# EAGLE schematic seamonster_buffered3 (EAGLE 9.0.1)

## Sheet 1 of 5: Power Filtering & Bypass
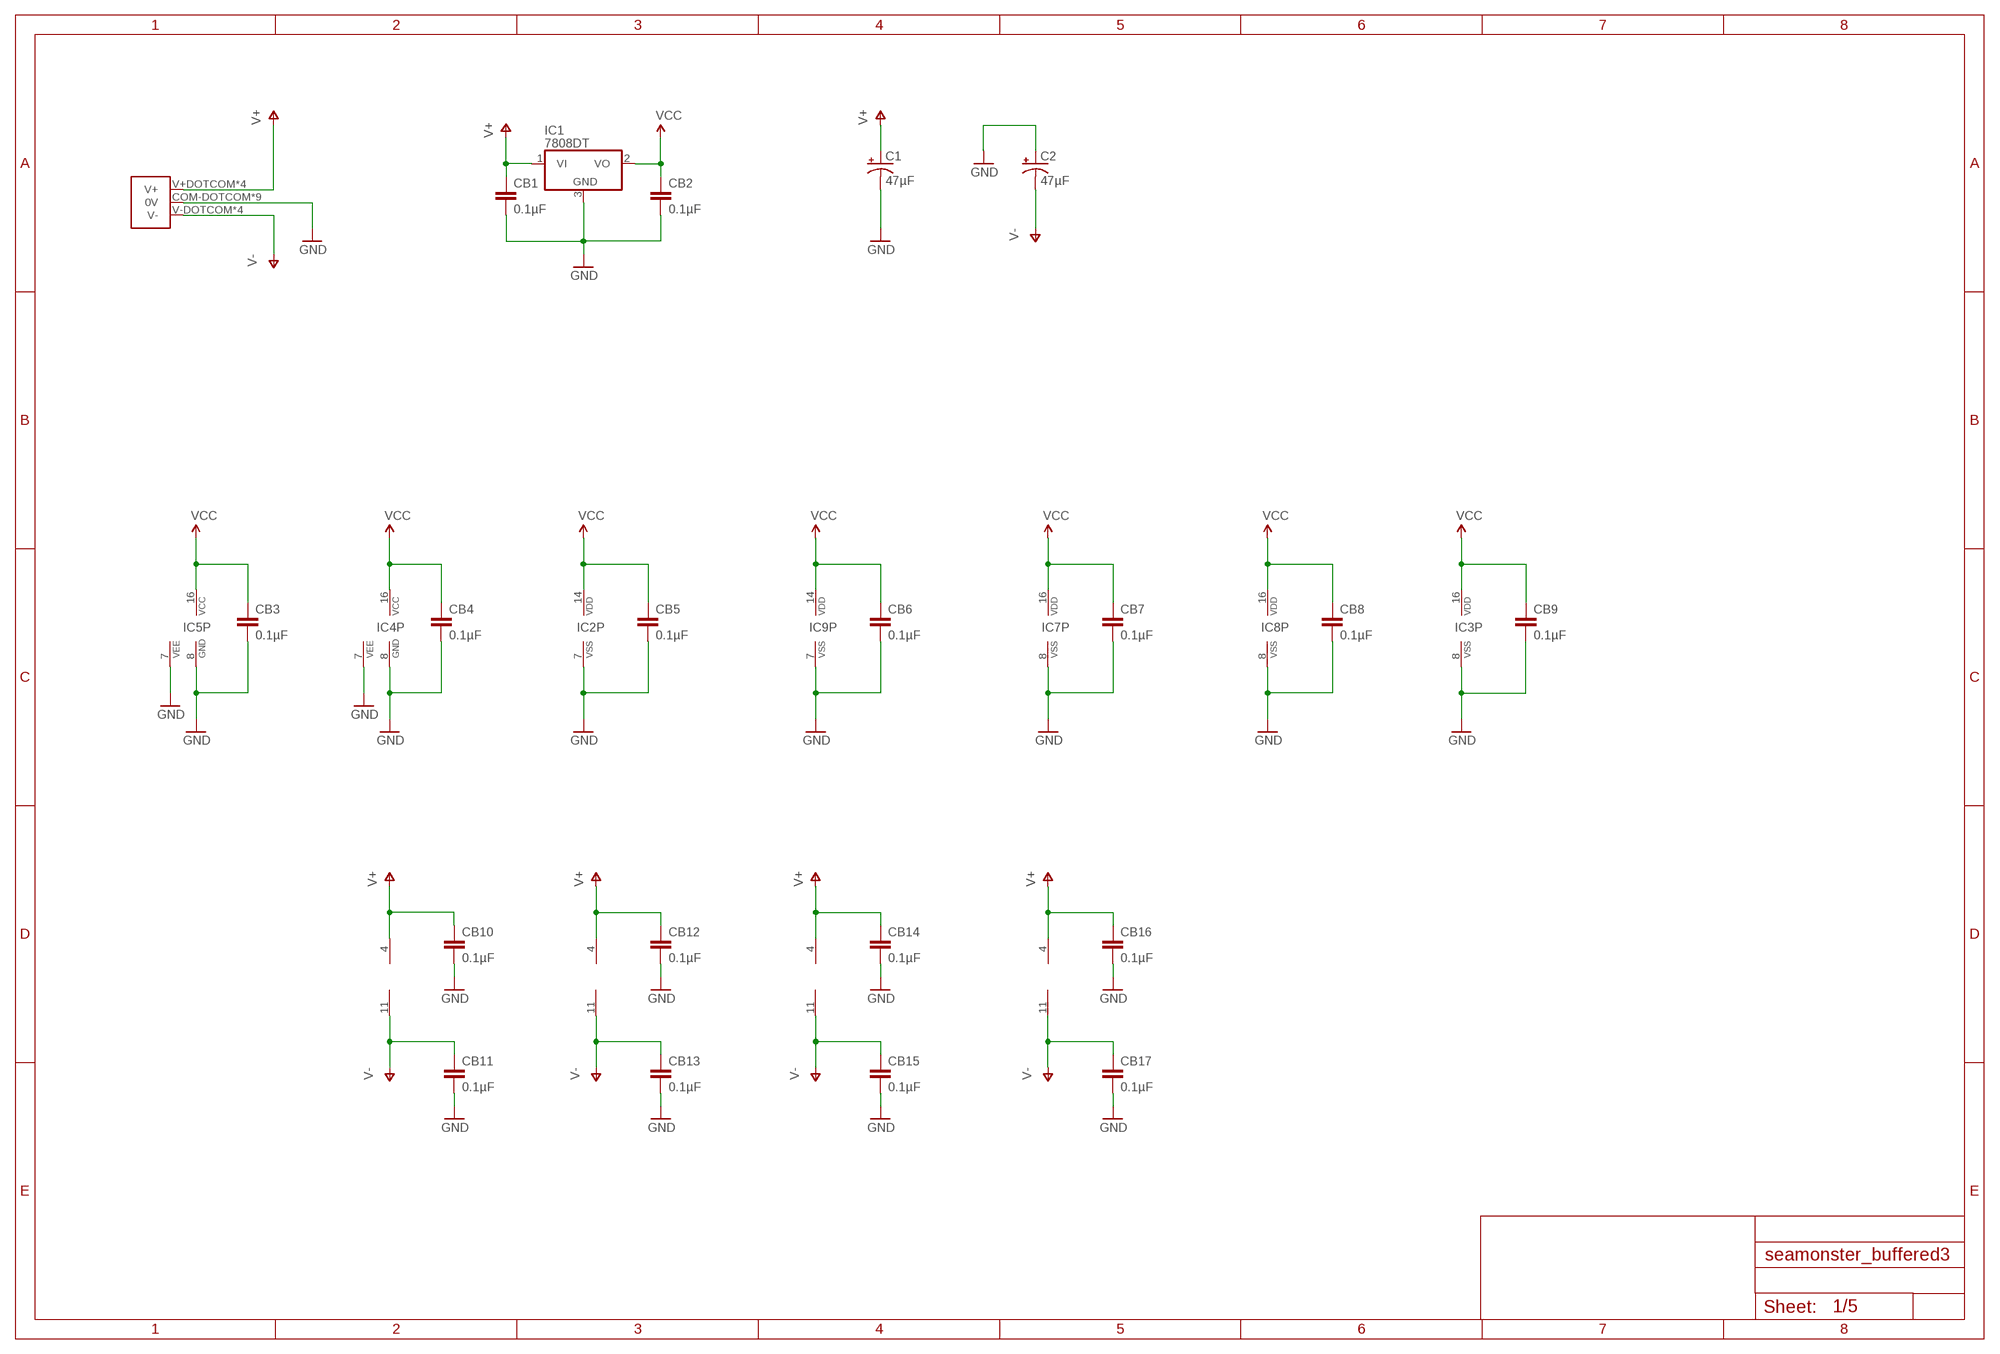
[diagram p0: schematic, sheet 1]

### Parts
C1  47µF  CAP_POLPTH2  [CPOL-RADIAL-10UF-25V]
C2  47µF  CAP_POLPTH2  [CPOL-RADIAL-10UF-25V]
CB1  0.1µF  CAP0805  [0805]
CB2  0.1µF  CAP0805  [0805]
CB3  0.1µF  CAP0805  [0805]
CB4  0.1µF  CAP0805  [0805]
CB5  0.1µF  CAP0805  [0805]
CB6  0.1µF  CAP0805  [0805]
CB7  0.1µF  CAP0805  [0805]
CB8  0.1µF  CAP0805  [0805]
CB9  0.1µF  CAP0805  [0805]
CB10  0.1µF  CAP0805  [0805]
CB11  0.1µF  CAP0805  [0805]
CB12  0.1µF  CAP0805  [0805]
CB13  0.1µF  CAP0805  [0805]
CB14  0.1µF  CAP0805  [0805]
CB15  0.1µF  CAP0805  [0805]
CB16  0.1µF  CAP0805  [0805]
CB17  0.1µF  CAP0805  [0805]
IC1  7808DT  [TO252]
IC2  40106D  [SO14]
IC3  4040D  [SO16]
IC4  4051D  [SO16]
IC5  4051D  [SO16]
IC7  4046D  [SO16]
IC8  4046D  [SO16]
IC9  4070D  [SO14]
U1  TL084  TL074_SMD  [SO14]
U2  TL084  TL074_SMD  [SO14]
U3  TL084  TL074_SMD  [SO14]
U4  TL084D  [SO14]
U$1  COMBO_POWER  [COMBO_POWER]

### Nets
GND: C1.2(-) C2.1(+) CB1.2 CB2.2 CB3.2 CB4.2 CB5.2 CB6.2 CB7.2 CB8.2 CB9.2 CB10.2 CB11.2 CB12.2 CB13.2 CB14.2 CB15.2 CB16.2 CB17.2 IC1.3(GND) IC2.7(P:VSS) IC3.8(VSS) IC4.7(VEE) IC4.8(GND) IC5.7(VEE) IC5.8(GND) IC7.8(VSS) IC8.8(VSS) IC9.7(P:VSS) U$1.COM-DOTCOM(0V) U$1.COM-EURO1(0V) U$1.COM-EURO2(0V) U$1.COM-EURO3(0V) U$1.COM-EURO4(0V) U$1.COM-EURO5(0V) U$1.COM-EURO6(0V) U$1.COM-MOTM1(0V) U$1.COM_MOTM2(0V) ; also sheet 2,3,4,5
V+: C1.1(+) CB1.1 CB10.1 CB12.1 CB14.1 CB16.1 IC1.1(VI) U1.4(P:V+) U2.4(P:V+) U3.4(P:V+) U4.4(P:V+) U$1.V+DOTCOM(V+) U$1.V+EURO1(V+) U$1.V+EURO2(V+) U$1.V+MOTM(V+) ; also sheet 3
V-: C2.2(-) CB11.1 CB13.1 CB15.1 CB17.1 U1.11(P:V-) U2.11(P:V-) U3.11(P:V-) U4.11(P:V-) U$1.V-DOTCOM(V-) U$1.V-EURO1(V-) U$1.V-EURO2(V-) U$1.V-MOTM(V-) ; also sheet 3
VCC: CB2.1 CB3.1 CB4.1 CB5.1 CB6.1 CB7.1 CB8.1 CB9.1 IC1.2(VO) IC2.14(P:VDD) IC3.16(VDD) IC4.16(VCC) IC5.16(VCC) IC7.16(VDD) IC8.16(VDD) IC9.14(P:VDD) ; also sheet 3
Unconnected: IC2.12(F:O) IC2.13(F:I)

## Sheet 2 of 5: Clock Oscillator & Divider
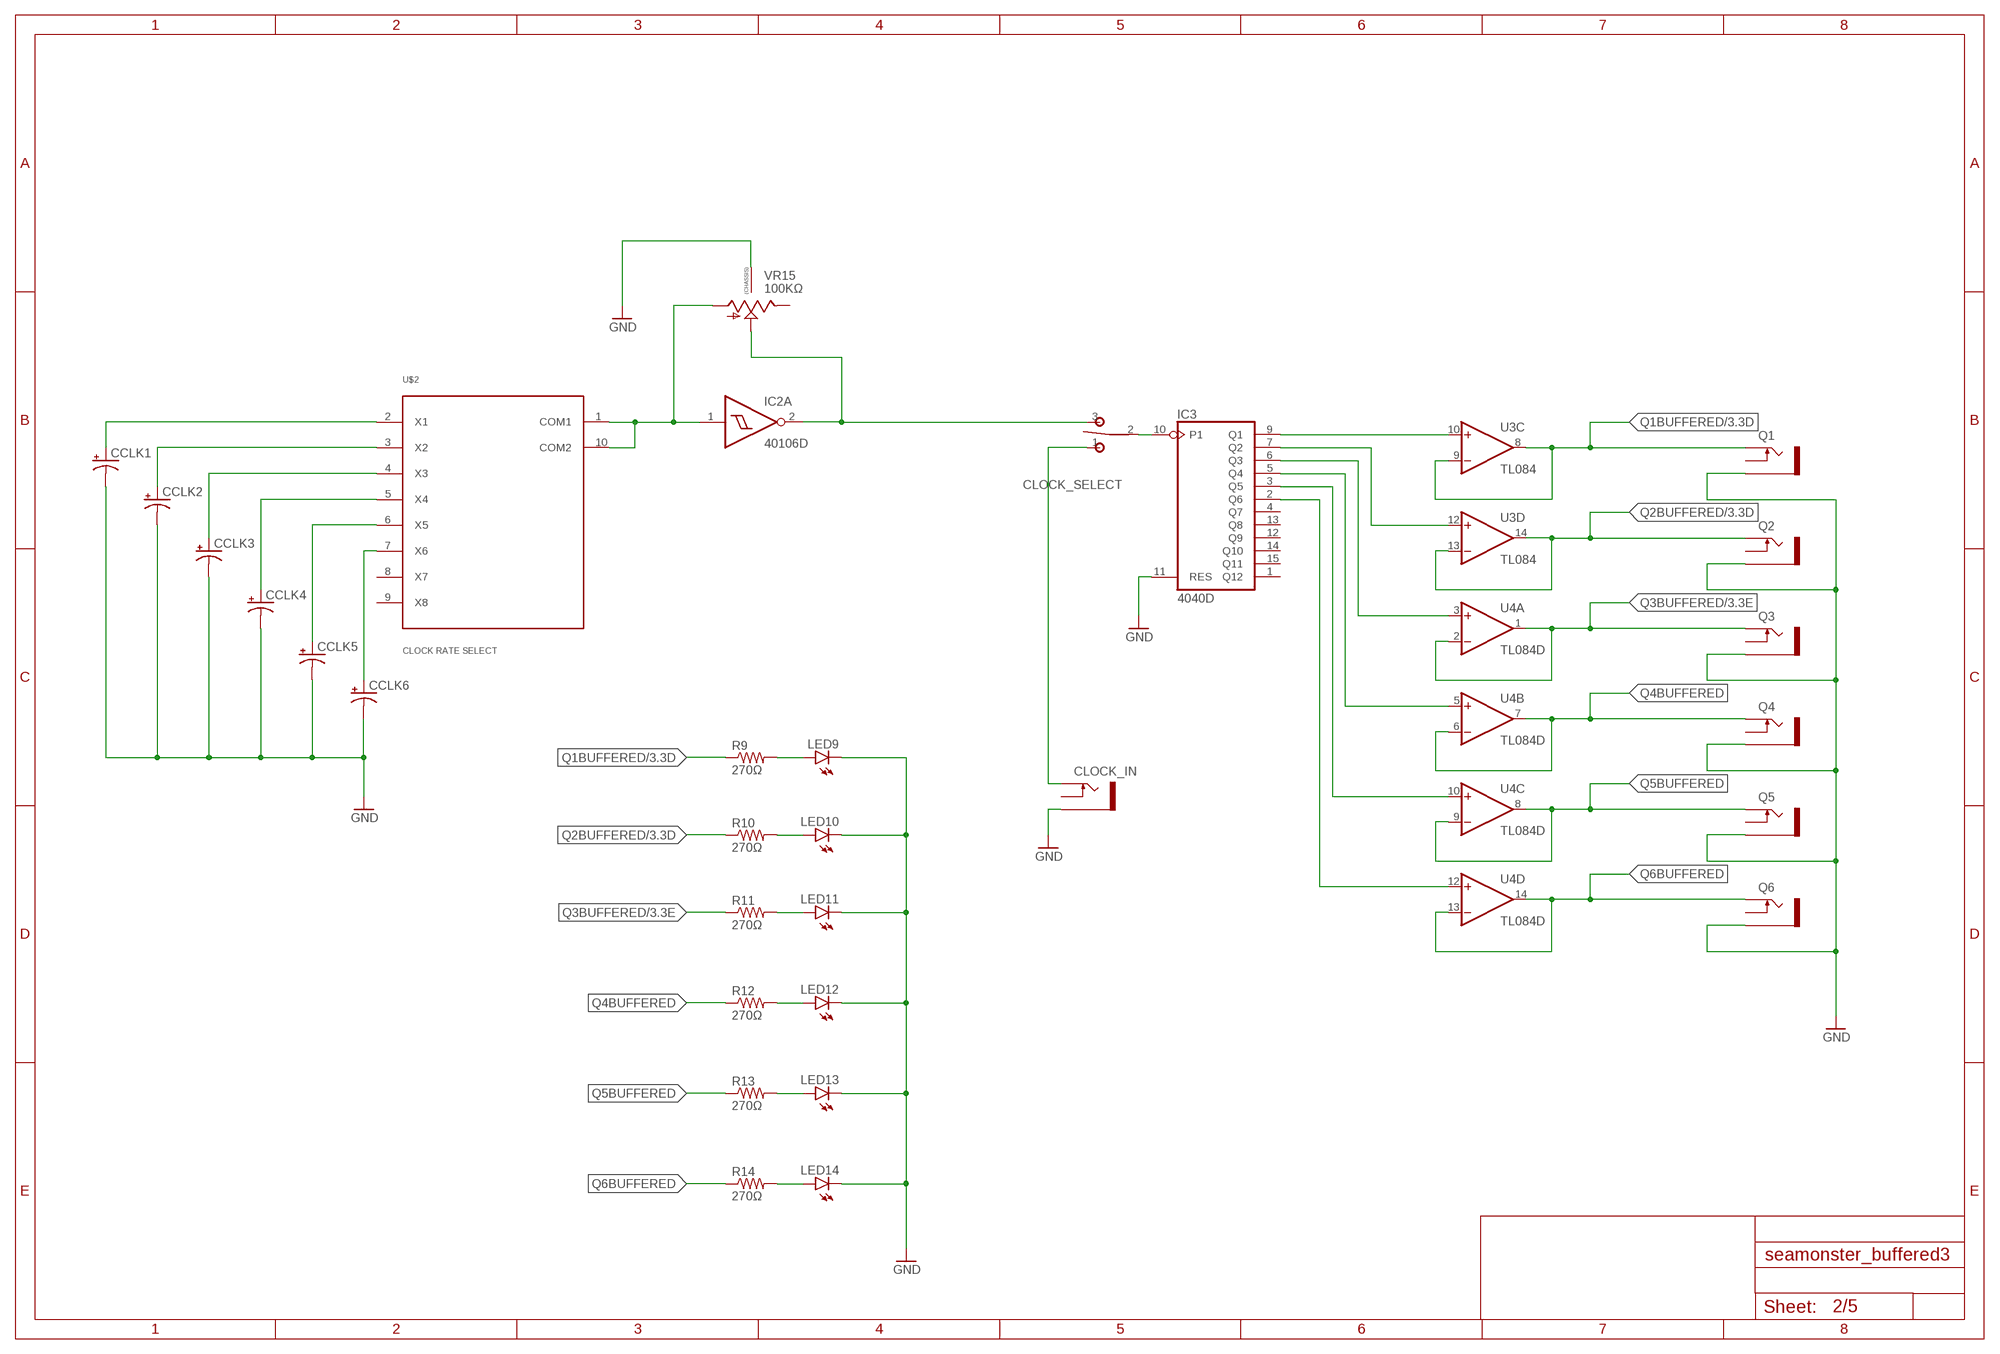
[diagram p1: schematic, sheet 2]

### Parts
CCLK1  10UF-25V-20%(PTH)  [CPOL-RADIAL-10UF-25V]
CCLK2  10UF-25V-20%(PTH)  [CPOL-RADIAL-10UF-25V]
CCLK3  10UF-25V-20%(PTH)  [CPOL-RADIAL-10UF-25V]
CCLK4  10UF-25V-20%(PTH)  [CPOL-RADIAL-10UF-25V]
CCLK5  10UF-25V-20%(PTH)  [CPOL-RADIAL-10UF-25V]
CCLK6  10UF-25V-20%(PTH)  [CPOL-RADIAL-10UF-25V]
CLOCK_IN  THONKICONNNEW  [WQP-PJ301M-12_JACK]
CLOCK_SELECT  SPDT ON-ON  T-80-T-SPDT-ON-OFF-ON  [M9040P]
LED9  LED3MM  [LED3MM]
LED10  LED3MM  [LED3MM]
LED11  LED3MM  [LED3MM]
LED12  LED3MM  [LED3MM]
LED13  LED3MM  [LED3MM]
LED14  LED3MM  [LED3MM]
Q1  THONKICONNNEW  [WQP-PJ301M-12_JACK]
Q2  THONKICONNNEW  [WQP-PJ301M-12_JACK]
Q3  THONKICONNNEW  [WQP-PJ301M-12_JACK]
Q4  THONKICONNNEW  [WQP-PJ301M-12_JACK]
Q5  THONKICONNNEW  [WQP-PJ301M-12_JACK]
Q6  THONKICONNNEW  [WQP-PJ301M-12_JACK]
R9  270Ω  RESISTOR0805-RES  [0805]
R10  270Ω  RESISTOR0805-RES  [0805]
R11  270Ω  RESISTOR0805-RES  [0805]
R12  270Ω  RESISTOR0805-RES  [0805]
R13  270Ω  RESISTOR0805-RES  [0805]
R14  270Ω  RESISTOR0805-RES  [0805]
U$2  CLOCK RATE SELECT  ALPHA_ROTARY_SWITCH  [ALPHA_SR1712F]
VR15  100KΩ  9MM_SNAP-IN_POT_CHASSIS  [9MM_SNAP-IN_POT]

### Nets
GND: CCLK1.2(-) CCLK2.2(-) CCLK3.2(-) CCLK4.2(-) CCLK5.2(-) CCLK6.2(-) CLOCK_IN.P$3_SLEEVE(SLEEVE) IC3.11(RES) LED9.K(C) LED10.K(C) LED11.K(C) LED12.K(C) LED13.K(C) LED14.K(C) Q1.P$3_SLEEVE(SLEEVE) Q2.P$3_SLEEVE(SLEEVE) Q3.P$3_SLEEVE(SLEEVE) Q4.P$3_SLEEVE(SLEEVE) Q5.P$3_SLEEVE(SLEEVE) Q6.P$3_SLEEVE(SLEEVE) VR15.CHASSIS2 ; also sheet 1,3,4,5
N$2: IC2.1(A:I) U$2.1(COM1) U$2.10(COM2) VR15.1(A)
N$3: CCLK1.1(+) U$2.2(X1)
N$4: CCLK2.1(+) U$2.3(X2)
N$5: CCLK3.1(+) U$2.4(X3)
N$6: CCLK4.1(+) U$2.5(X4)
N$7: CCLK5.1(+) U$2.6(X5)
N$8: CCLK6.1(+) U$2.7(X6)
N$43: CLOCK_SELECT.3(S) IC2.2(A:O) VR15.2(S)
N$50: CLOCK_SELECT.2(P) IC3.10(P1)
N$51: LED9.A R9.2
N$61: IC3.9(Q1) U3.10(C:+IN)
N$65: LED10.A R10.2
N$66: LED11.A R11.2
N$67: LED12.A R12.2
N$68: LED13.A R13.2
N$69: LED14.A R14.2
N$70: CLOCK_IN.P$1_TIP(TIP) CLOCK_SELECT.1(O)
Q1BUFFERED: Q1.P$1_TIP(TIP) R9.1 U3.8(C:OUT) U3.9(C:-IN) ; also sheet 3
Q2: IC3.7(Q2) U3.12(D:+IN)
Q2BUFFERED: Q2.P$1_TIP(TIP) R10.1 U3.13(D:-IN) U3.14(D:OUT) ; also sheet 3
Q3: IC3.6(Q3) U4.3(A:+IN)
Q3BUFFERED: Q3.P$1_TIP(TIP) R11.1 U4.1(A:OUT) U4.2(A:-IN) ; also sheet 3
Q4: IC3.5(Q4) U4.5(B:+IN)
Q4BUFFERED: Q4.P$1_TIP(TIP) R12.1 U4.6(B:-IN) U4.7(B:OUT)
Q5: IC3.3(Q5) U4.10(C:+IN)
Q5BUFFERED: Q5.P$1_TIP(TIP) R13.1 U4.8(C:OUT) U4.9(C:-IN)
Q6: IC3.2(Q6) U4.12(D:+IN)
Q6BUFFERED: Q6.P$1_TIP(TIP) R14.1 U4.13(D:-IN) U4.14(D:OUT)
Unconnected: CLOCK_IN.P$2_SWITCH(SWITCH) IC3.1(Q12) IC3.4(Q7) IC3.12(Q9) IC3.13(Q8) IC3.14(Q10) IC3.15(Q11) Q1.P$2_SWITCH(SWITCH) Q2.P$2_SWITCH(SWITCH) Q3.P$2_SWITCH(SWITCH) Q4.P$2_SWITCH(SWITCH) Q5.P$2_SWITCH(SWITCH) Q6.P$2_SWITCH(SWITCH) U$2.8(X7) U$2.9(X8) VR15.3(E)

## Sheet 3 of 5: Multiplexing
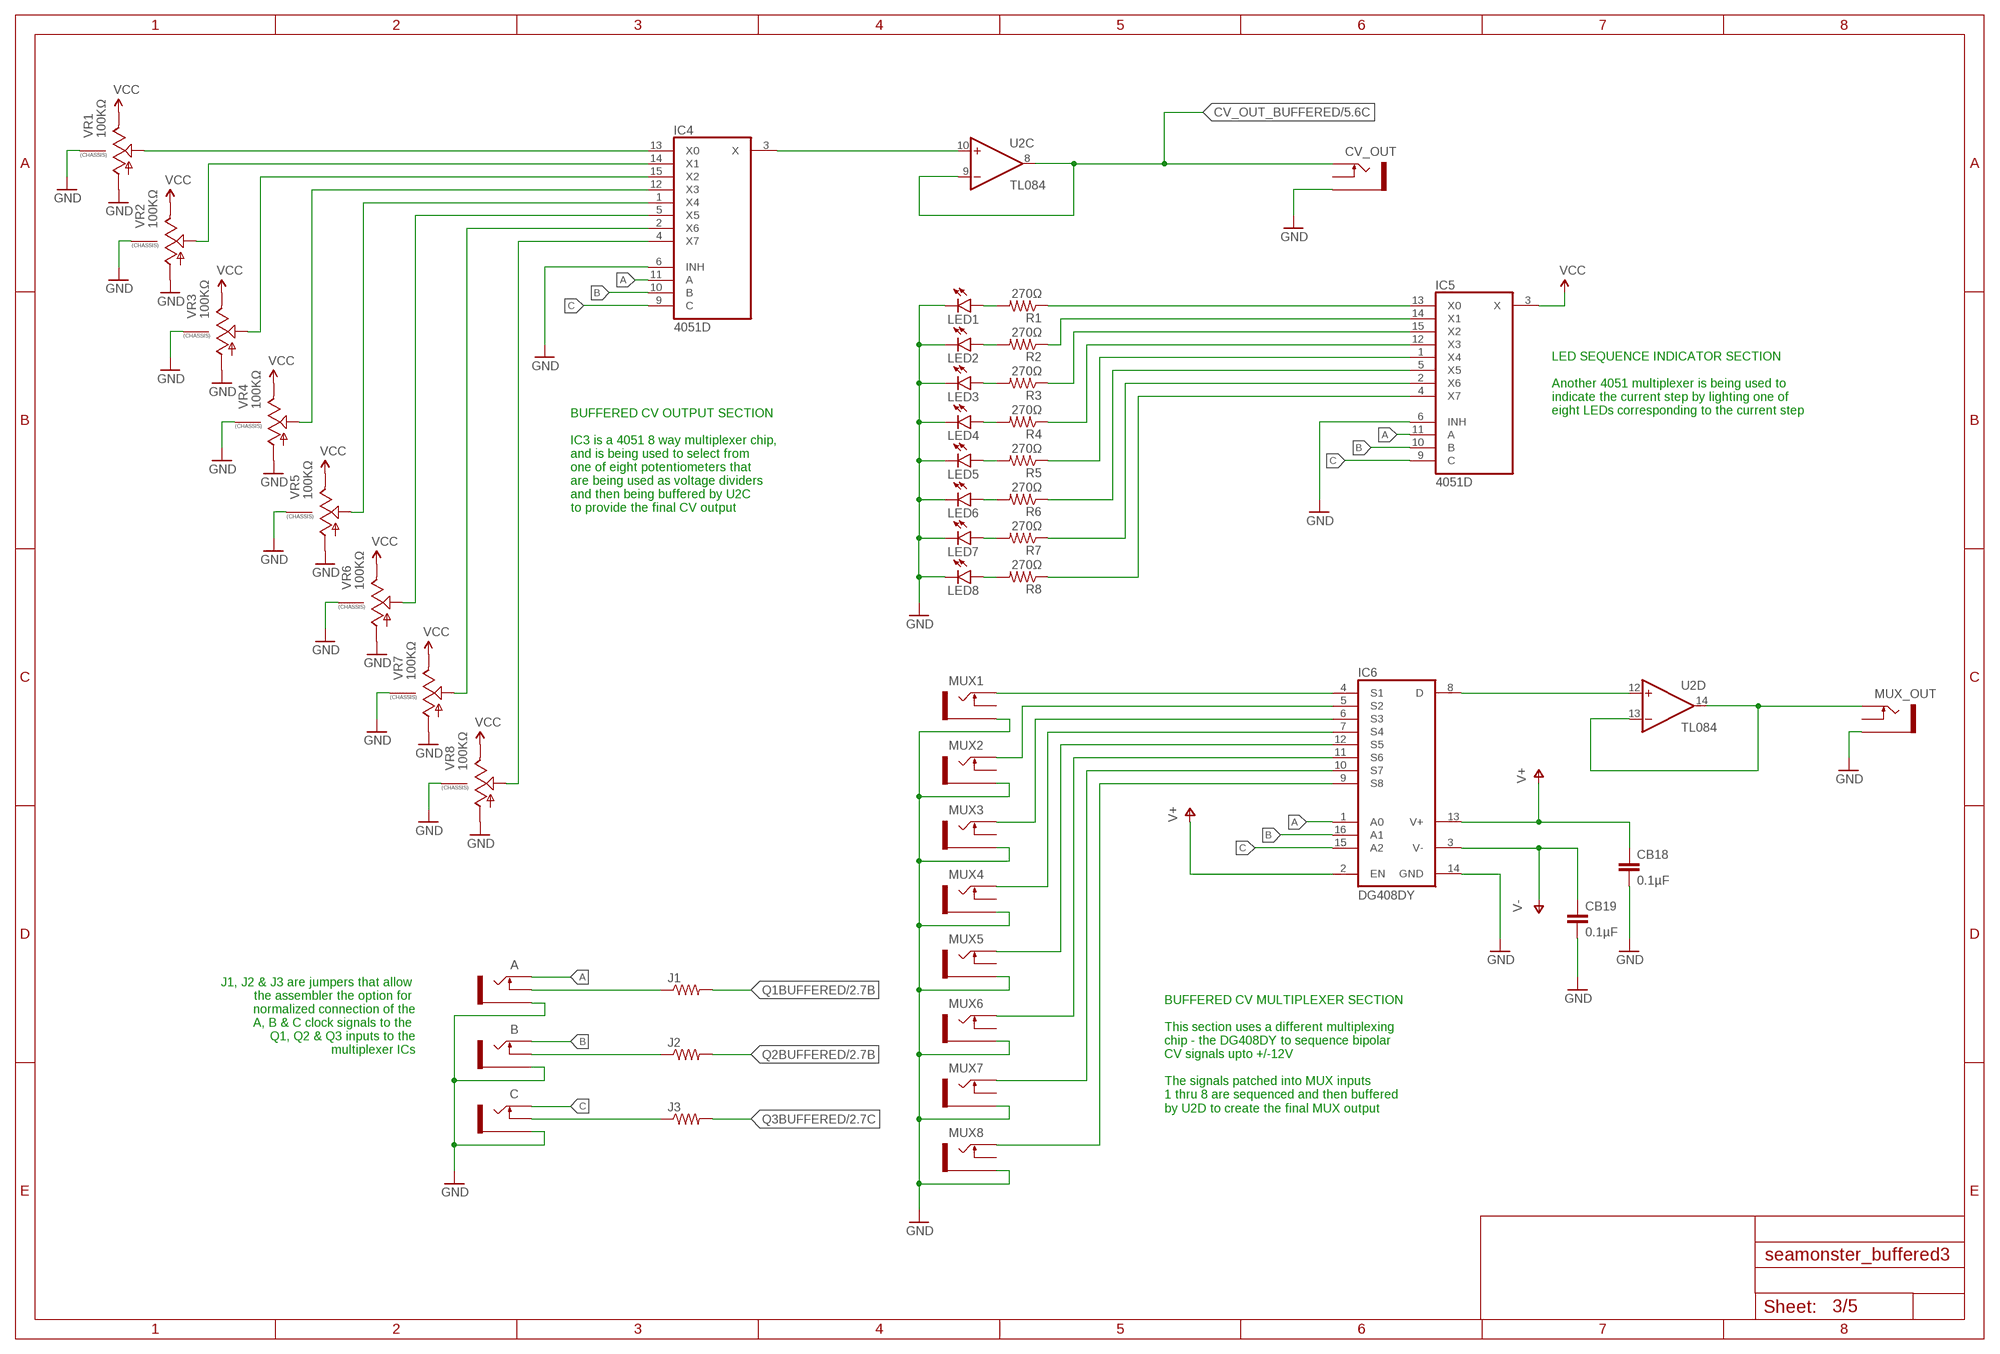
[diagram p2: schematic, sheet 3]

### Parts
A  THONKICONNNEW  [WQP-PJ301M-12_JACK]
B  THONKICONNNEW  [WQP-PJ301M-12_JACK]
C  THONKICONNNEW  [WQP-PJ301M-12_JACK]
CB18  0.1µF  CAP0805  [0805]
CB19  0.1µF  CAP0805  [0805]
CV_OUT  THONKICONNNEW  [WQP-PJ301M-12_JACK]
IC6  DG408DY  [SO16]
J1  RESISTOR0805-RES  [0805]
J2  RESISTOR0805-RES  [0805]
J3  RESISTOR0805-RES  [0805]
LED1  LED3MM  [LED3MM]
LED2  LED3MM  [LED3MM]
LED3  LED3MM  [LED3MM]
LED4  LED3MM  [LED3MM]
LED5  LED3MM  [LED3MM]
LED6  LED3MM  [LED3MM]
LED7  LED3MM  [LED3MM]
LED8  LED3MM  [LED3MM]
MUX1  THONKICONNNEW  [WQP-PJ301M-12_JACK]
MUX2  THONKICONNNEW  [WQP-PJ301M-12_JACK]
MUX3  THONKICONNNEW  [WQP-PJ301M-12_JACK]
MUX4  THONKICONNNEW  [WQP-PJ301M-12_JACK]
MUX5  THONKICONNNEW  [WQP-PJ301M-12_JACK]
MUX6  THONKICONNNEW  [WQP-PJ301M-12_JACK]
MUX7  THONKICONNNEW  [WQP-PJ301M-12_JACK]
MUX8  THONKICONNNEW  [WQP-PJ301M-12_JACK]
MUX_OUT  THONKICONNNEW  [WQP-PJ301M-12_JACK]
R1  270Ω  RESISTOR0805-RES  [0805]
R2  270Ω  RESISTOR0805-RES  [0805]
R3  270Ω  RESISTOR0805-RES  [0805]
R4  270Ω  RESISTOR0805-RES  [0805]
R5  270Ω  RESISTOR0805-RES  [0805]
R6  270Ω  RESISTOR0805-RES  [0805]
R7  270Ω  RESISTOR0805-RES  [0805]
R8  270Ω  RESISTOR0805-RES  [0805]
VR1  100KΩ  9MM_SNAP-IN_POT_CHASSIS  [9MM_SNAP-IN_POT]
VR2  100KΩ  9MM_SNAP-IN_POT_CHASSIS  [9MM_SNAP-IN_POT]
VR3  100KΩ  9MM_SNAP-IN_POT_CHASSIS  [9MM_SNAP-IN_POT]
VR4  100KΩ  9MM_SNAP-IN_POT_CHASSIS  [9MM_SNAP-IN_POT]
VR5  100KΩ  9MM_SNAP-IN_POT_CHASSIS  [9MM_SNAP-IN_POT]
VR6  100KΩ  9MM_SNAP-IN_POT_CHASSIS  [9MM_SNAP-IN_POT]
VR7  100KΩ  9MM_SNAP-IN_POT_CHASSIS  [9MM_SNAP-IN_POT]
VR8  100KΩ  9MM_SNAP-IN_POT_CHASSIS  [9MM_SNAP-IN_POT]

### Nets
A: A.P$1_TIP(TIP) IC4.11(A) IC5.11(A) IC6.1(A0)
B: B.P$1_TIP(TIP) IC4.10(B) IC5.10(B) IC6.16(A1)
C: C.P$1_TIP(TIP) IC4.9(C) IC5.9(C) IC6.15(A2)
CV_OUT: IC4.3(X) U2.10(C:+IN)
CV_OUT_BUFFERED: CV_OUT.P$1_TIP(TIP) U2.8(C:OUT) U2.9(C:-IN) ; also sheet 5
GND: A.P$3_SLEEVE(SLEEVE) B.P$3_SLEEVE(SLEEVE) C.P$3_SLEEVE(SLEEVE) CB18.2 CB19.2 CV_OUT.P$3_SLEEVE(SLEEVE) IC4.6(INH) IC5.6(INH) IC6.14(GND) LED1.K(C) LED2.K(C) LED3.K(C) LED4.K(C) LED5.K(C) LED6.K(C) LED7.K(C) LED8.K(C) MUX1.P$3_SLEEVE(SLEEVE) MUX2.P$3_SLEEVE(SLEEVE) MUX3.P$3_SLEEVE(SLEEVE) MUX4.P$3_SLEEVE(SLEEVE) MUX5.P$3_SLEEVE(SLEEVE) MUX6.P$3_SLEEVE(SLEEVE) MUX7.P$3_SLEEVE(SLEEVE) MUX8.P$3_SLEEVE(SLEEVE) MUX_OUT.P$3_SLEEVE(SLEEVE) VR1.1(A) VR1.CHASSIS2 VR2.1(A) VR2.CHASSIS2 VR3.1(A) VR3.CHASSIS2 VR4.1(A) VR4.CHASSIS2 VR5.1(A) VR5.CHASSIS2 VR6.1(A) VR6.CHASSIS2 VR7.1(A) VR7.CHASSIS2 VR8.1(A) VR8.CHASSIS2 ; also sheet 1,2,4,5
MUX1: IC6.4(S1) MUX1.P$1_TIP(TIP)
MUX2: IC6.5(S2) MUX2.P$1_TIP(TIP)
MUX3: IC6.6(S3) MUX3.P$1_TIP(TIP)
MUX4: IC6.7(S4) MUX4.P$1_TIP(TIP)
MUX5: IC6.12(S5) MUX5.P$1_TIP(TIP)
MUX6: IC6.11(S6) MUX6.P$1_TIP(TIP)
MUX7: IC6.10(S7) MUX7.P$1_TIP(TIP)
MUX8: IC6.9(S8) MUX8.P$1_TIP(TIP)
N$1: IC6.8(D) U2.12(D:+IN)
N$9: MUX_OUT.P$1_TIP(TIP) U2.13(D:-IN) U2.14(D:OUT)
N$10: LED1.A R1.2
N$11: LED2.A R2.2
N$12: LED3.A R3.2
N$13: LED4.A R4.2
N$14: LED5.A R5.2
N$15: LED6.A R6.2
N$16: LED7.A R7.2
N$17: LED8.A R8.2
N$18: IC4.13(X0) VR1.2(S)
N$19: IC5.13(X0) R1.1
N$20: IC5.14(X1) R2.1
N$21: IC5.15(X2) R3.1
N$22: IC5.12(X3) R4.1
N$23: IC5.1(X4) R5.1
N$24: IC5.5(X5) R6.1
N$25: IC5.2(X6) R7.1
N$26: IC5.4(X7) R8.1
N$27: IC4.14(X1) VR2.2(S)
N$28: IC4.15(X2) VR3.2(S)
N$29: IC4.12(X3) VR4.2(S)
N$30: IC4.1(X4) VR5.2(S)
N$31: IC4.5(X5) VR6.2(S)
N$32: IC4.2(X6) VR7.2(S)
N$33: IC4.4(X7) VR8.2(S)
N$34: A.P$2_SWITCH(SWITCH) J1.1
N$37: B.P$2_SWITCH(SWITCH) J2.1
N$76: C.P$2_SWITCH(SWITCH) J3.1
Q1BUFFERED: J1.2 ; also sheet 2
Q2BUFFERED: J2.2 ; also sheet 2
Q3BUFFERED: J3.2 ; also sheet 2
V+: CB18.1 IC6.2(EN) IC6.13(V+) ; also sheet 1
V-: CB19.1 IC6.3(V-) ; also sheet 1
VCC: IC5.3(X) VR1.3(E) VR2.3(E) VR3.3(E) VR4.3(E) VR5.3(E) VR6.3(E) VR7.3(E) VR8.3(E) ; also sheet 1
Unconnected: CV_OUT.P$2_SWITCH(SWITCH) MUX1.P$2_SWITCH(SWITCH) MUX2.P$2_SWITCH(SWITCH) MUX3.P$2_SWITCH(SWITCH) MUX4.P$2_SWITCH(SWITCH) MUX5.P$2_SWITCH(SWITCH) MUX6.P$2_SWITCH(SWITCH) MUX7.P$2_SWITCH(SWITCH) MUX8.P$2_SWITCH(SWITCH) MUX_OUT.P$2_SWITCH(SWITCH)

### Notes on the sheet
- LED SEQUENCE INDICATOR SECTION
  
  Another 4051 multiplexer is being used to
  indicate the current step by lighting one of
  eight LEDs corresponding to the current step
- BUFFERED CV OUTPUT SECTION
  
  IC3 is a 4051 8 way multiplexer chip, 
  and is being used to select from
  one of eight potentiometers that
  are being used as voltage dividers
  and then being buffered by U2C
  to provide the final CV output
- J1, J2 & J3 are jumpers that allow 
  the assembler the option for 
  normalized connection of the
  A, B & C clock signals to the 
  Q1, Q2 & Q3 inputs to the
  multiplexer ICs
- BUFFERED CV MULTIPLEXER SECTION
  
  This section uses a different multiplexing
  chip - the DG408DY to sequence bipolar
  CV signals upto +/-12V
  
  The signals patched into MUX inputs
  1 thru 8 are sequenced and then buffered
  by U2D to create the final MUX output

## Sheet 4 of 5: Fixed Frequency Oscillators
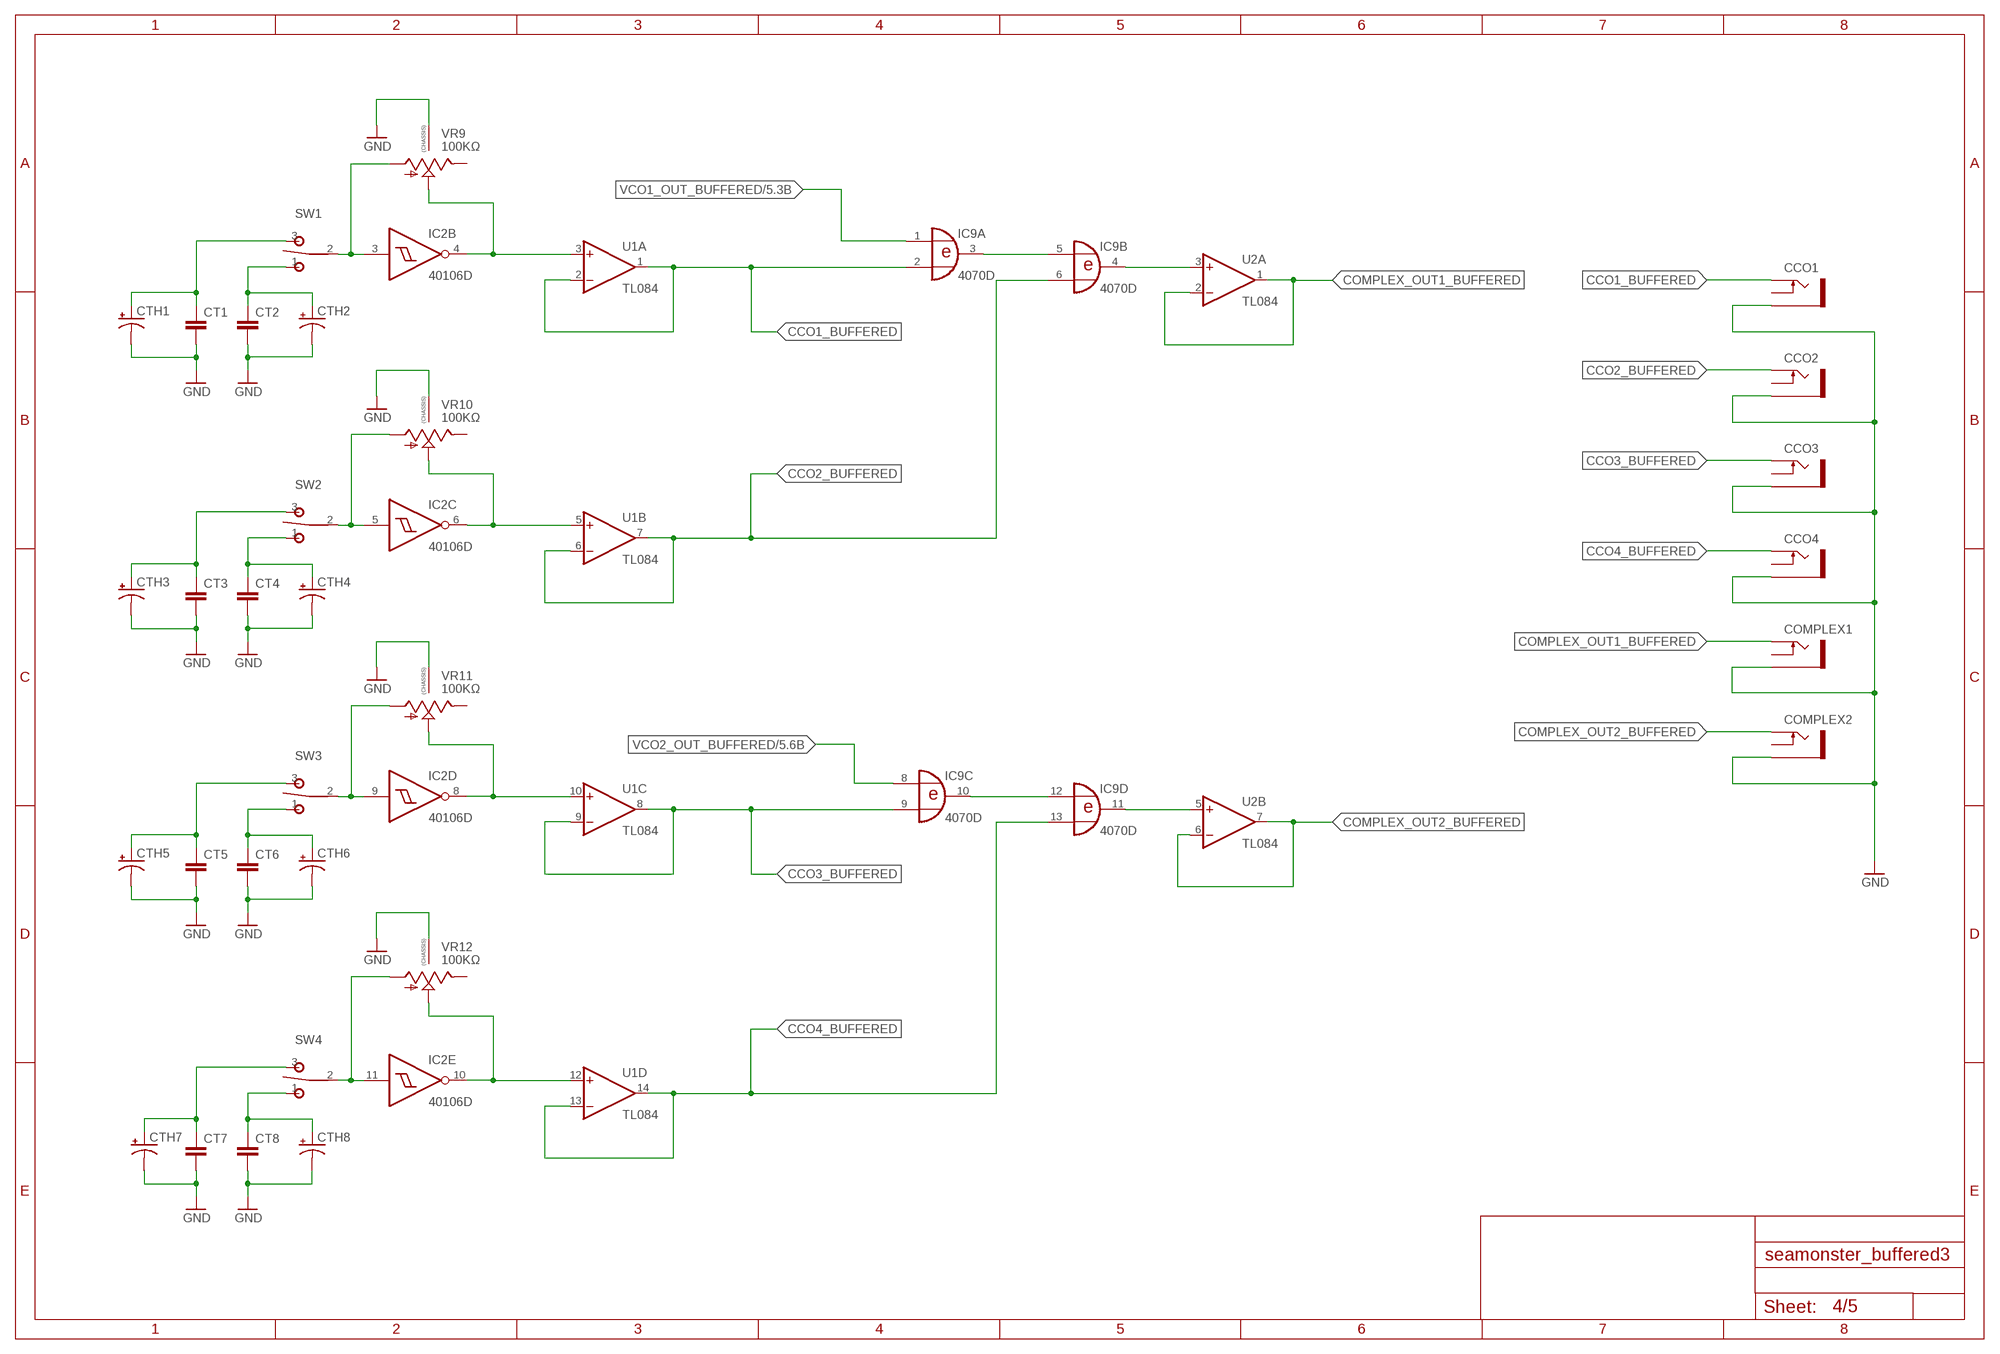
[diagram p3: schematic, sheet 4]

### Parts
CCO1  THONKICONNNEW  [WQP-PJ301M-12_JACK]
CCO2  THONKICONNNEW  [WQP-PJ301M-12_JACK]
CCO3  THONKICONNNEW  [WQP-PJ301M-12_JACK]
CCO4  THONKICONNNEW  [WQP-PJ301M-12_JACK]
COMPLEX1  THONKICONNNEW  [WQP-PJ301M-12_JACK]
COMPLEX2  THONKICONNNEW  [WQP-PJ301M-12_JACK]
CT1  CAP0805  [0805]
CT2  CAP0805  [0805]
CT3  CAP0805  [0805]
CT4  CAP0805  [0805]
CT5  CAP0805  [0805]
CT6  CAP0805  [0805]
CT7  CAP0805  [0805]
CT8  CAP0805  [0805]
CTH1  CAP_POLPTH2  [CPOL-RADIAL-10UF-25V]
CTH2  CAP_POLPTH2  [CPOL-RADIAL-10UF-25V]
CTH3  CAP_POLPTH2  [CPOL-RADIAL-10UF-25V]
CTH4  CAP_POLPTH2  [CPOL-RADIAL-10UF-25V]
CTH5  CAP_POLPTH2  [CPOL-RADIAL-10UF-25V]
CTH6  CAP_POLPTH2  [CPOL-RADIAL-10UF-25V]
CTH7  CAP_POLPTH2  [CPOL-RADIAL-10UF-25V]
CTH8  CAP_POLPTH2  [CPOL-RADIAL-10UF-25V]
SW1  SPDT ON-ON  T-80-T-SPDT-ON-OFF-ON  [M9040P]
SW2  SPDT ON-ON  T-80-T-SPDT-ON-OFF-ON  [M9040P]
SW3  SPDT ON-ON  T-80-T-SPDT-ON-OFF-ON  [M9040P]
SW4  SPDT ON-ON  T-80-T-SPDT-ON-OFF-ON  [M9040P]
VR9  100KΩ  9MM_SNAP-IN_POT_CHASSIS  [9MM_SNAP-IN_POT]
VR10  100KΩ  9MM_SNAP-IN_POT_CHASSIS  [9MM_SNAP-IN_POT]
VR11  100KΩ  9MM_SNAP-IN_POT_CHASSIS  [9MM_SNAP-IN_POT]
VR12  100KΩ  9MM_SNAP-IN_POT_CHASSIS  [9MM_SNAP-IN_POT]

### Nets
CCO1_BUFFERED: CCO1.P$1_TIP(TIP) IC9.2(A:I1) U1.1(A:OUT) U1.2(A:-IN)
CCO2_BUFFERED: CCO2.P$1_TIP(TIP) IC9.6(B:I1) U1.6(B:-IN) U1.7(B:OUT)
CCO3_BUFFERED: CCO3.P$1_TIP(TIP) IC9.9(C:I1) U1.8(C:OUT) U1.9(C:-IN)
CCO4_BUFFERED: CCO4.P$1_TIP(TIP) IC9.13(D:I1) U1.13(D:-IN) U1.14(D:OUT)
COMPLEX_OUT1_BUFFERED: COMPLEX1.P$1_TIP(TIP) U2.1(A:OUT) U2.2(A:-IN)
COMPLEX_OUT2_BUFFERED: COMPLEX2.P$1_TIP(TIP) U2.6(B:-IN) U2.7(B:OUT)
GND: CCO1.P$3_SLEEVE(SLEEVE) CCO2.P$3_SLEEVE(SLEEVE) CCO3.P$3_SLEEVE(SLEEVE) CCO4.P$3_SLEEVE(SLEEVE) COMPLEX1.P$3_SLEEVE(SLEEVE) COMPLEX2.P$3_SLEEVE(SLEEVE) CT1.2 CT2.2 CT3.2 CT4.2 CT5.2 CT6.2 CT7.2 CT8.2 CTH1.2(-) CTH2.2(-) CTH3.2(-) CTH4.2(-) CTH5.2(-) CTH6.2(-) CTH7.2(-) CTH8.2(-) VR9.CHASSIS2 VR10.CHASSIS2 VR11.CHASSIS2 VR12.CHASSIS2 ; also sheet 1,2,3,5
INV_B_IN: IC2.3(B:I) SW1.2(P) VR9.1(A)
INV_B_OUT: IC2.4(B:O) U1.3(A:+IN) VR9.2(S)
INV_C_IN: IC2.5(C:I) SW2.2(P) VR10.1(A)
INV_C_OUT: IC2.6(C:O) U1.5(B:+IN) VR10.2(S)
INV_D_IN: IC2.9(D:I) SW3.2(P) VR11.1(A)
INV_D_OUT: IC2.8(D:O) U1.10(C:+IN) VR11.2(S)
INV_E_IN: IC2.11(E:I) SW4.2(P) VR12.1(A)
INV_E_OUT: IC2.10(E:O) U1.12(D:+IN) VR12.2(S)
N$35: IC9.3(A:O) IC9.5(B:I0)
N$36: IC9.10(C:O) IC9.12(D:I0)
N$38: IC9.4(B:O) U2.3(A:+IN)
N$39: IC9.11(D:O) U2.5(B:+IN)
N$47: CT2.1 CTH2.1(+) SW1.1(O)
N$52: CT1.1 CTH1.1(+) SW1.3(S)
N$55: CT4.1 CTH4.1(+) SW2.1(O)
N$56: CT3.1 CTH3.1(+) SW2.3(S)
N$59: CT6.1 CTH6.1(+) SW3.1(O)
N$60: CT5.1 CTH5.1(+) SW3.3(S)
N$63: CT8.1 CTH8.1(+) SW4.1(O)
N$64: CT7.1 CTH7.1(+) SW4.3(S)
VCO1_OUT_BUFFERED: IC9.1(A:I0) ; also sheet 5
VCO2_OUT_BUFFERED: IC9.8(C:I0) ; also sheet 5
Unconnected: CCO1.P$2_SWITCH(SWITCH) CCO2.P$2_SWITCH(SWITCH) CCO3.P$2_SWITCH(SWITCH) CCO4.P$2_SWITCH(SWITCH) COMPLEX1.P$2_SWITCH(SWITCH) COMPLEX2.P$2_SWITCH(SWITCH) VR9.3(E) VR10.3(E) VR11.3(E) VR12.3(E)

## Sheet 5 of 5: Voltage Controlled Oscillators
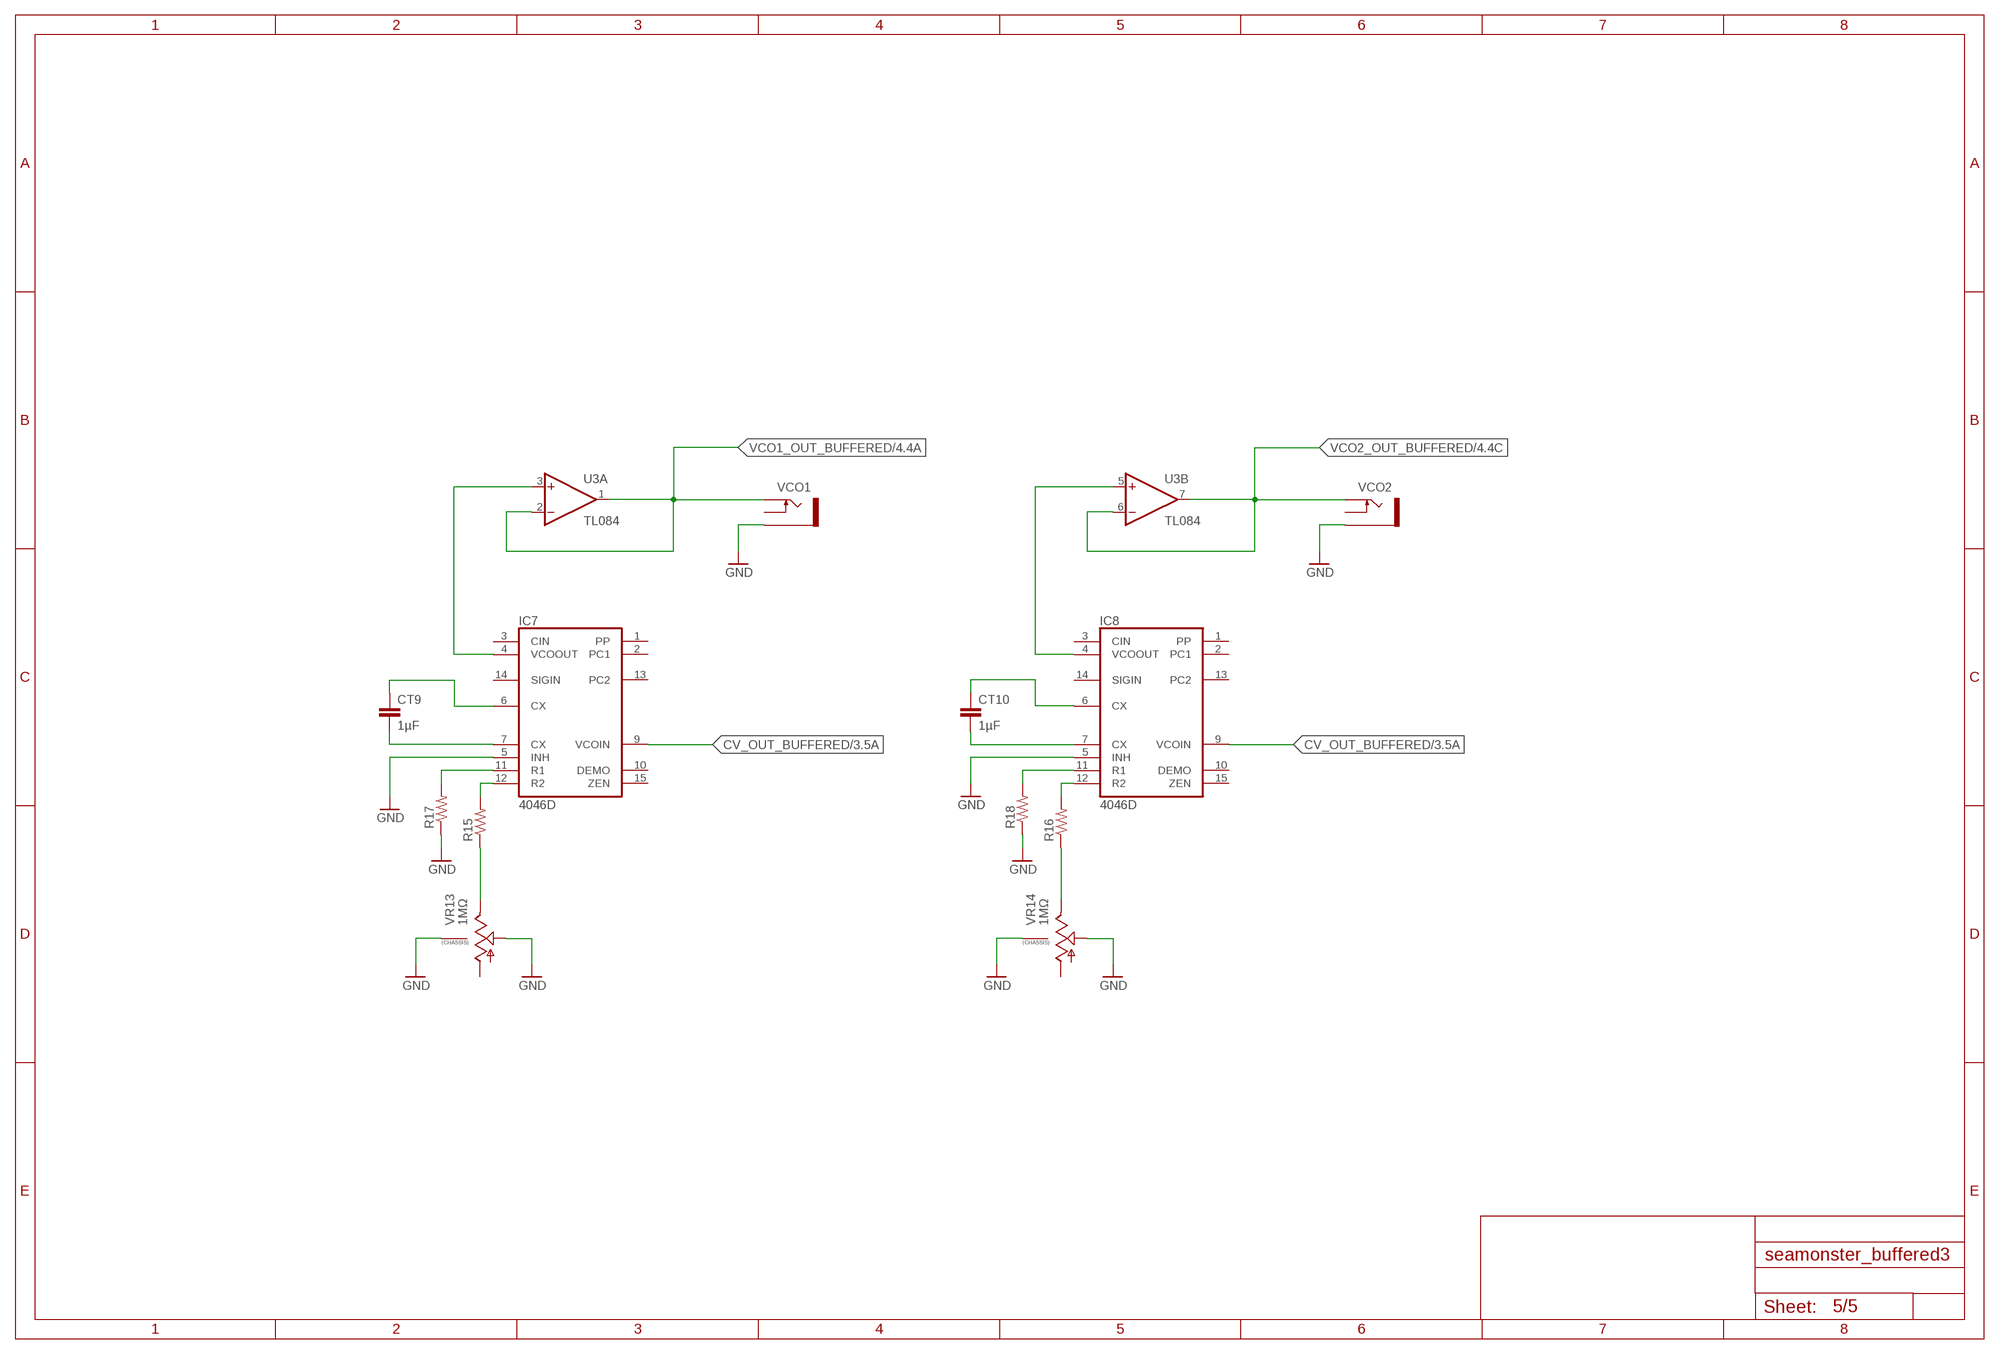
[diagram p4: schematic, sheet 5]

### Parts
CT9  1µF  CAP0805  [0805]
CT10  1µF  CAP0805  [0805]
R15  RESISTOR0805-RES  [0805]
R16  RESISTOR0805-RES  [0805]
R17  RESISTOR0805-RES  [0805]
R18  RESISTOR0805-RES  [0805]
VCO1  THONKICONNNEW  [WQP-PJ301M-12_JACK]
VCO2  THONKICONNNEW  [WQP-PJ301M-12_JACK]
VR13  1MΩ  9MM_SNAP-IN_POT_CHASSIS  [9MM_SNAP-IN_POT]
VR14  1MΩ  9MM_SNAP-IN_POT_CHASSIS  [9MM_SNAP-IN_POT]

### Nets
CV_OUT_BUFFERED: IC7.9(VCOIN) IC8.9(VCOIN) ; also sheet 3
GND: IC7.5(INH) IC8.5(INH) R17.1 R18.1 VCO1.P$3_SLEEVE(SLEEVE) VCO2.P$3_SLEEVE(SLEEVE) VR13.2(S) VR13.CHASSIS2 VR14.2(S) VR14.CHASSIS2 ; also sheet 1,2,3,4
N$40: IC7.12(R2) R15.2
N$42: R15.1 VR13.3(E)
N$44: CT9.1 IC7.6(CX)
N$45: CT9.2 IC7.7(CX)
N$48: CT10.1 IC8.6(CX)
N$49: CT10.2 IC8.7(CX)
N$71: IC8.12(R2) R16.2
N$72: R16.1 VR14.3(E)
N$74: IC8.11(R1) R18.2
N$75: IC7.11(R1) R17.2
VCO1_OUT: IC7.4(VCOOUT) U3.3(A:+IN)
VCO1_OUT_BUFFERED: U3.1(A:OUT) U3.2(A:-IN) VCO1.P$1_TIP(TIP) ; also sheet 4
VCO2_OUT: IC8.4(VCOOUT) U3.5(B:+IN)
VCO2_OUT_BUFFERED: U3.6(B:-IN) U3.7(B:OUT) VCO2.P$1_TIP(TIP) ; also sheet 4
Unconnected: IC7.1(PP) IC7.2(PC1) IC7.3(CIN) IC7.10(DEMO) IC7.13(PC2) IC7.14(SIGIN) IC7.15(ZEN) IC8.1(PP) IC8.2(PC1) IC8.3(CIN) IC8.10(DEMO) IC8.13(PC2) IC8.14(SIGIN) IC8.15(ZEN) VCO1.P$2_SWITCH(SWITCH) VCO2.P$2_SWITCH(SWITCH) VR13.1(A) VR14.1(A)

## Library data of the parts
A B C CCO1-CCO4 CLOCK_IN COMPLEX1 COMPLEX2 CV_OUT MUX1-MUX8 MUX_OUT Q1-Q6 VCO1 VCO2 = MusicThingModular:THONKICONN: 3.5mm socket for Eurorack modular synths
C1 C2 CTH1-CTH8 = SparkFun-Capacitors:CAP_POL: Capacitor Polarized These are standard SMD and PTH capacitors. Normally 10uF, 47uF, and 100uF in electrolytic and tantalum varieties. Always verify the external diameter of the through hole cap, it varies with capacity, voltage, and manufacturer. The EIA devices should be standard.
CB1-CB19 CT1-CT10 = SparkFun-Capacitors:CAP: Capacitor Standard 0603 ceramic capacitor, and 0.1" leaded capacitor.
CCLK1-CCLK6 = SparkFun-Capacitors:10UF-25V-20%(PTH): CAP-08440; PROD_ID: CAP-08440
CLOCK_SELECT SW1-SW4 = MusicThingModular:T-80-T-SPDT-ON-OFF-ON
IC1 = linear:78*: Positive VOLTAGE REGULATOR Source: http://cache.national.com/ds/LM/LM78L05.pdf http://www.fairchildsemi.com/ds/LM/LM7805.pdf
IC2 = 40xx:40106: Hex SCHMITT TRIGGER
IC3 = 40xx:4040: 12-stage binary/ripple COUNTER
IC4 IC5 = 40xx:4051: 8-channel ANALOG MULTIPLEXER
IC6 = maxim:DG408DY: ANALOG MULTIPLEXER; MPN: DG408DY+T; OC_FARNELL: 1077070; OC_NEWARK: 67K3719
IC7 IC8 = 40xx:4046: Micropower PLL
IC9 = 40xx:4070: Quad 2-input XOR
J1-J3 R1-R18 = SparkFun-Resistors:RESISTOR: Resistor Basic schematic elements and footprints for 0603, 1206, and PTH resistors.
LED1-LED14 = SparkFun-LED:LED: LEDs Standard schematic elements and footprints for 5mm, 3mm, 1206, and 0603 sized LEDs. 5mm - Spark Fun Electronics SKU : COM-00529 (and others)
U1-U3 = MusicThingModular:TL074: Generic Quad Op Amp
U4 = linear:TL084: OP AMP
U$1 = combo_power:COMBO_POWER
U$2 = alpha_8pos_rotary_switch:ALPHA_ROTARY_SWITCH
VR1-VR15 = MusicThingModular:9MM_SNAP-IN_POT_CHASSIS: 9mm vertical snap-in pot, Alpha / Panasonic style, with a connection to the metal chassis for grounding